# Altium schematic sheet Pixracer_V1_FMU_Alternative_4.SchDoc
size 335 x 216 mm; Origin: Eagle
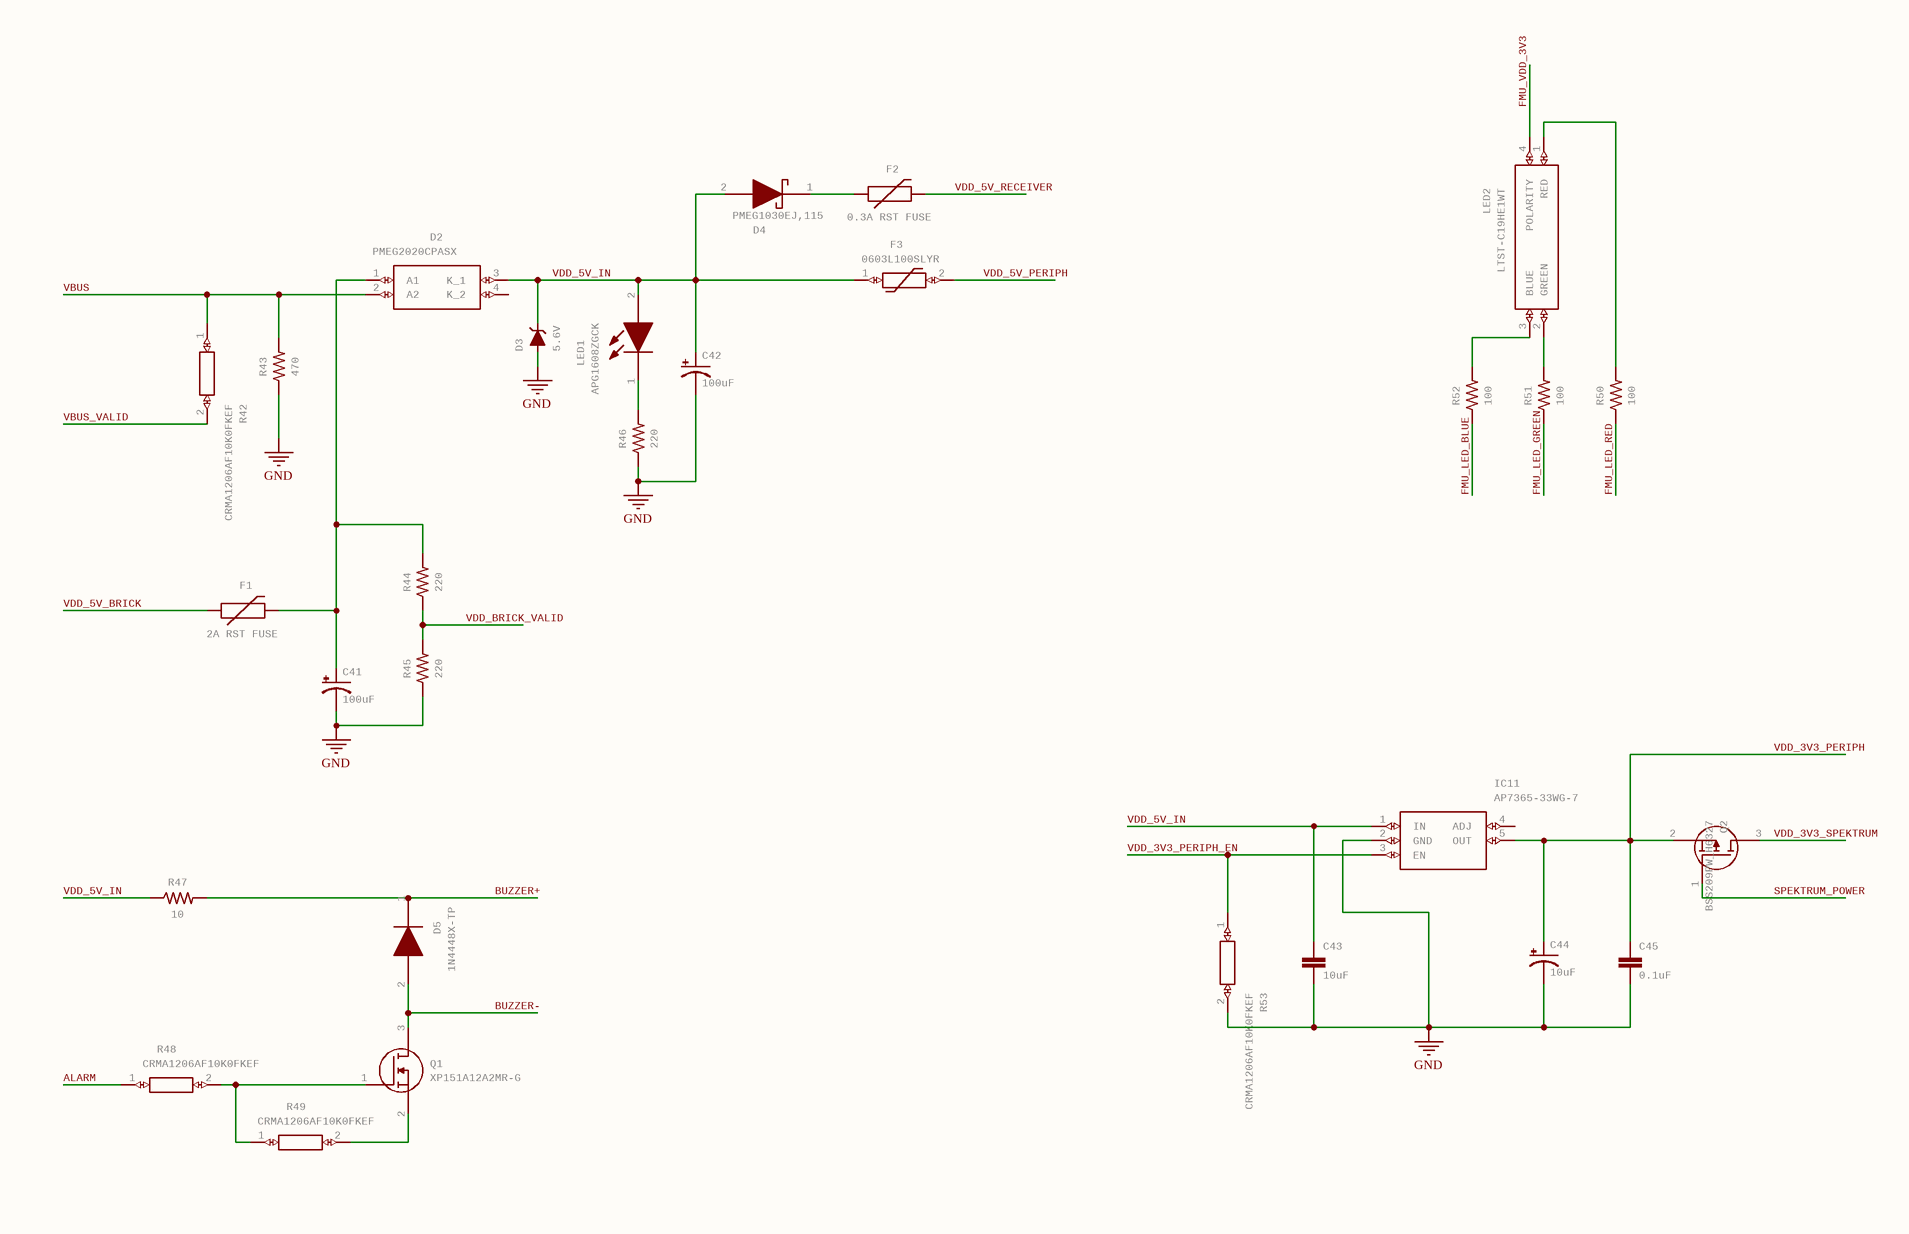
[diagram p0: Pixracer_V1_FMU_Alternative_4.SchDoc]

## Parts
C41  100uF  [1206-POLAR]
C42  100uF  [1206-POLAR]
C43  10uF  [1206]
C44  10uF  [0603-POLAR]
C45  0.1uF  [0603]
D2  PMEG2020CPASX  [PMEG2020CPASX]
D3  5.6V  [SOT23-3]
D4  PMEG1030EJ,115  [SODFL2512X80N]
D5  1N4448X-TP  [1N4448XTP]
F1  2A RST FUSE  [1206]
F2  0.3A RST FUSE  [0805]
F3  0603L100SLYR  [0603L050SLYR]
IC11  AP7365-33WG-7  [SOT95P285X130-5N]
LED1  APG1608ZGCK  [LEDC1608X28N]
LED2  LTST-C19HE1WT  [LTST-C19HE1WT]
Q1  XP151A12A2MR-G  [SOT95P280X130-3N]
Q2  BSS209PW_H6327  [SOT65P210X100-3N]
R42  CRMA1206AF10K0FKEF  [RESC3216X74N]
R43  470  [0603]
R44  220  [0603]
R45  220  [0603]
R46  220  [0603]
R47  10  [0603]
R48  CRMA1206AF10K0FKEF  [RESC3216X74N]
R49  CRMA1206AF10K0FKEF  [RESC3216X74N]
R50  100  [0603]
R51  100  [0603]
R52  100  [0603]
R53  CRMA1206AF10K0FKEF  [RESC3216X74N]

## Nets
GND: C41.2(-) C42.2(-) C43.2 C44.- C45.2 D3.1(A) IC11.2(GND) R43.1 R45.1 R46.1 R53.2
ALARM: R48.1
BUZZER+: D5.1(K) R47.2
BUZZER-: D5.2(A) Q1.3(D)
FMU_LED_BLUE: R52.1
FMU_LED_GREEN: R51.1
FMU_LED_RED: R50.1
FMU_VDD_3V3: LED2.4(POLARITY)
SPEKTRUM_POWER: Q2.1(G)
VBUS: D2.2(A2) R42.1 R43.2
VBUS_VALID: R42.2
VDD_3V3_PERIPH: C44.+ C45.1 IC11.5(OUT) Q2.2(S)
VDD_3V3_PERIPH_EN: IC11.3(EN) R53.1
VDD_3V3_SPEKTRUM: Q2.3(D)
VDD_5V_BRICK: F1.1
VDD_5V_IN: C42.1(+) C43.1 D2.3(K_1) D3.3(C) D4.2(A) F3.1 IC11.1(IN) LED1.2(A) R47.1
VDD_5V_PERIPH: F3.2
VDD_5V_RECEIVER: F2.2
VDD_BRICK_VALID: R44.1 R45.2
NetC41_1: C41.1(+) D2.1(A1) F1.2 R44.2
NetD4_1: D4.1(K) F2.1
NetLED1_1: LED1.1(K) R46.2
NetLED2_1: LED2.1(RED) R50.2
NetLED2_2: LED2.2(GREEN) R51.2
NetLED2_3: LED2.3(BLUE) R52.2
NetQ1_1: Q1.1(G) R48.2 R49.1
NetQ1_2: Q1.2(S) R49.2

Not connected (* = marked no-connect by the designer): D2 4(K_2); IC11 4(ADJ)

## Library data of the parts
C41 C42 = 100UF-POLAR-1206-6.3V-20%(TANT): 100ÂµF polarized capacitors    A capacitor is a passive two-terminal electrical component used to store electrical energy temporarily in an electric field.; GateName_1: G$1; SymbolName_1: CAP_POL; PROD_ID: CAP-14093; DeviceName: -1206-6.3V-20%(TANT); LibraryName: SparkFun-Capacitors; DeviceSetName: 100UF-POLAR
C43 = 10UF-1206-6.3V-20%: 10.0ÂµF ceramic capacitors    A capacitor is a passive two-terminal electrical component used to store electrical energy temporarily in an electric field.; GateName_1: G$1; SymbolName_1: CAP; PROD_ID: CAP-10057; DeviceName: -1206-6.3V-20%; LibraryName: SparkFun-Capacitors; DeviceSetName: 10UF
C44 = 10UF-POLAR-0603-6.3V-20%(TANT): 10.0ÂµF polarized capacitors    A capacitor is a passive two-terminal electrical component used to store electrical energy temporarily in an electric field.; GateName_1: G$1; SymbolName_1: CAP_POL; PROD_ID: CAP-13210; DeviceName: -0603-6.3V-20%(TANT); LibraryName: SparkFun-Capacitors; DeviceSetName: 10UF-POLAR
C45 = 0.1UF-0603-100V-10%-X7R-WE: 0.1ÂµF ceramic capacitors    A capacitor is a passive two-terminal electrical component used to store electrical energy temporarily in an electric field.; GateName_1: G$1; SymbolName_1: CAP; PROD_ID: CAP-16436; DeviceName: -0603-100V-10%-X7R-WE; LibraryName: SparkFun-Capacitors; DeviceSetName: 0.1UF
D2 = PMEG2020CPASX: Schottky Diodes & Rectifiers 20V 2A dual MEGA Schottky   Source:  Datasheet; MANUFACTURER_NAME: Nexperia; GateName_1: G$1; SymbolName_1: PMEG2020CPASX; LibraryName: SamacSys_Parts; DeviceSetName: PMEG2020CPASX; DESCRIPTION: Schottky Diodes & Rectifiers 20V 2A dual MEGA Schottky; HEIGHT: 0.65mm; MANUFACTURER_PART_NUMBER: PMEG2020CPASX; MOUSER_PART_NUMBER: 771-PMEG2020CPASX; MOUSER_PRICE-STOCK: https://www.mouser.co.uk/ProductDetail/Nexperia/PMEG2020CPASX?qs=K2OaAKmNuLimeK0EUCzHKQ%3D%3D
D3 = DIODE-ZENER-MMBZ5233BLT1G: Zener Diode    A Zener diode allows current to flow from its anode to its cathode like a normal semiconductor diode, but it also permits current to flow in the reverse direction when its "Zener voltage" is reached. - WIkipedia; GateName_1: G$1; PROD_ID: DIO-14123; SymbolName_1: DIODE-ZENER; DeviceName: -MMBZ5233BLT1G; LibraryName: SparkFun-DiscreteSemi; DeviceSetName: DIODE-ZENER
D4 = PMEG1030EJ,115: Schottky Diodes & Rectifiers SCHOTTKY 10V 3A   Source:  Datasheet; MANUFACTURER_NAME: Nexperia; GateName_1: G$1; SymbolName_1: PMEG1030EJ,115; LibraryName: SamacSys_Parts; DeviceSetName: PMEG1030EJ,115; DESCRIPTION: Schottky Diodes & Rectifiers SCHOTTKY 10V 3A; HEIGHT: 0.8mm; MANUFACTURER_PART_NUMBER: PMEG1030EJ,115; MOUSER_PART_NUMBER: 771-PMEG1030EJ-T/R; MOUSER_PRICE-STOCK: https://www.mouser.co.uk/ProductDetail/Nexperia/PMEG1030EJ115?qs=LOCUfHb8d9vmk7P%2FuYbs5A%3D%3D
D5 = 1N4448X-TP: Diodes - General Purpose, Power, Switching 250mA 75V 500mA 250mA 150mW 75Vbr   Source:  Datasheet; MANUFACTURER_NAME: Micro Commercial Components (MCC); GateName_1: G$1; SymbolName_1: 1N4448X-TP; LibraryName: SamacSys_Parts; DeviceSetName: 1N4448X-TP; DESCRIPTION: Diodes - General Purpose, Power, Switching 250mA 75V 500mA 250mA 150mW 75Vbr; HEIGHT: 0.65mm; MANUFACTURER_PART_NUMBER: 1N4448X-TP; MOUSER_PART_NUMBER: 833-1N4448X-TP; MOUSER_PRICE-STOCK: https://www.mouser.com/Search/Refine.aspx?Keyword=833-1N4448X-TP
F1 = PPTC_6V500MA-2: Resettable Fuse PPTC    Resettable Fuse. Really a sort of resistor with a polymeric positive temperature coefficient whose resistance increases dramatically with an increase in temperature. When heated by the power passing through the resistance rises causing the current to be limited, protecting the circuit. This is achieved by the transition of the polymer from a crystalline to an amorphous state where the conductive carbon separates breaking the conductive pathways found in the cool crystalline structure. When a PPTC cools back down it resumes conducting letting the circuit turn back on.   SparkFun Products:  SparkFun RedBoard - Programmed with Arduino  Pro Micro - 5V/16MHz  Arduino Pro 328 - 5V/16MHz  MP3 Trigger; GateName_1: F1; PROD_ID: RES-08585; SymbolName_1: PPTC; DeviceName: _6V500MA-2; LibraryName: SparkFun-Fuses; DeviceSetName: PPTC
F2 = PPTC_6V500MA: Resettable Fuse PPTC    Resettable Fuse. Really a sort of resistor with a polymeric positive temperature coefficient whose resistance increases dramatically with an increase in temperature. When heated by the power passing through the resistance rises causing the current to be limited, protecting the circuit. This is achieved by the transition of the polymer from a crystalline to an amorphous state where the conductive carbon separates breaking the conductive pathways found in the cool crystalline structure. When a PPTC cools back down it resumes conducting letting the circuit turn back on.   SparkFun Products:  SparkFun RedBoard - Programmed with Arduino  Pro Micro - 5V/16MHz  Arduino Pro 328 - 5V/16MHz  MP3 Trigger; GateName_1: F1; PROD_ID: RES-13945; SymbolName_1: PPTC; DeviceName: _6V500MA; LibraryName: SparkFun-Fuses; DeviceSetName: PPTC
F3 = 0603L100SLYR: PTC 6V POLYFUSE SURF MOUNT 0603 SL 1.00A   Source:  Datasheet; MANUFACTURER_NAME: LITTELFUSE; GateName_1: G$1; SymbolName_1: 0603L100SLYR; LibraryName: SamacSys_Parts; DeviceSetName: 0603L100SLYR; DESCRIPTION: PTC 6V POLYFUSE SURF MOUNT 0603 SL 1.00A; HEIGHT: 0.75mm; MANUFACTURER_PART_NUMBER: 0603L100SLYR; MOUSER_PART_NUMBER: 576-0603L100SLYR; MOUSER_PRICE-STOCK: https://www.mouser.co.uk/ProductDetail/Littelfuse/0603L100SLYR?qs=%252BPPFKVzHyAKqCAJtLoK6vw%3D%3D
IC11 = AP7365-33WG-7: DiodesZetex AP7365-33WG-7, LDO Voltage Regulator, 600mA, 3.3 V +/-2%, 2  6 Vin, 5-Pin SOT-25   Source:  Datasheet; MANUFACTURER_NAME: Diodes Inc.; GateName_1: G$1; SymbolName_1: AP7365-33WG-7; LibraryName: SamacSys_Parts; DeviceSetName: AP7365-33WG-7; DESCRIPTION: DiodesZetex AP7365-33WG-7, LDO Voltage Regulator, 600mA, 3.3 V +/-2%, 2  6 Vin, 5-Pin SOT-25; HEIGHT: 1.3mm; MANUFACTURER_PART_NUMBER: AP7365-33WG-7; MOUSER_PART_NUMBER: 621-AP7365-33WG-7; MOUSER_PRICE-STOCK: https://www.mouser.co.uk/ProductDetail/Diodes-Incorporated/AP7365-33WG-7?qs=abZ1nkZpTuOZFvxvoFPL0w%3D%3D
LED1 = APG1608ZGCK: Standard LEDs - SMD 1.6X0.8MM   Source:  Datasheet; MANUFACTURER_NAME: Kingbright; GateName_1: G$1; SymbolName_1: APG1608ZGCK; LibraryName: SamacSys_Parts; DeviceSetName: APG1608ZGCK; DESCRIPTION: Standard LEDs - SMD 1.6X0.8MM; HEIGHT: 0.28mm; MANUFACTURER_PART_NUMBER: APG1608ZGCK; MOUSER_PART_NUMBER: 604-APG1608ZGCK; MOUSER_PRICE-STOCK: https://www.mouser.co.uk/ProductDetail/Kingbright/APG1608ZGCK?qs=Oo40KB9lBTmmOma0ledTcg%3D%3D
LED2 = LTST-C19HE1WT: LED,SMD,1.6x1.5x0.4mm,Red/Green/Blue Lite-On LTST-C19HE1WT 3 RGB LED, 470 / 525 / 624 nm 3-Pin, Rectangle Lens SMD package   Source:  Datasheet; GateName_1: G$1; SymbolName_1: LTST-C19HE1WT; LibraryName: SamacSys_Parts; DeviceSetName: LTST-C19HE1WT; DESCRIPTION: LED,SMD,1.6x1.5x0.4mm,Red/Green/Blue Lite-On LTST-C19HE1WT 3 RGB LED, 470 / 525 / 624 nm 3-Pin, Rectangle Lens SMD package; HEIGHT: mm; MANUFACTURER_NAME: Lite-On; MANUFACTURER_PART_NUMBER: LTST-C19HE1WT; MOUSER_PART_NUMBER: 859-LTST-C19HE1WT; MOUSER_PRICE-STOCK: https://www.mouser.co.uk/ProductDetail/Lite-On/LTST-C19HE1WT?qs=WAWaI72GHKxJLPArJA9%252BUw%3D%3D
Q1 = XP151A12A2MR-G: Power MOSFET   Source:  Datasheet; MANUFACTURER_NAME: Torex; GateName_1: G$1; SymbolName_1: XP151A12A2MR-G; LibraryName: SamacSys_Parts; DeviceSetName: XP151A12A2MR-G; DESCRIPTION: Power MOSFET; HEIGHT: 1.3mm; MANUFACTURER_PART_NUMBER: XP151A12A2MR-G; MOUSER_PART_NUMBER: 865-XP151A12A2MR-G; MOUSER_PRICE-STOCK: https://www.mouser.co.uk/ProductDetail/Torex-Semiconductor/XP151A12A2MR-G?qs=AsjdqWjXhJ%252BYt8dSaKx3TA%3D%3D
Q2 = BSS209PW_H6327: MOSFET P-Ch -20V -630mA SOT-323-3   Source:  Datasheet; MANUFACTURER_NAME: Infineon; MANUFACTURER_PART_NUMBER: BSS209PW H6327; GateName_1: G$1; SymbolName_1: BSS209PW_H6327; LibraryName: SamacSys_Parts; DeviceSetName: BSS209PW_H6327; DESCRIPTION: MOSFET P-Ch -20V -630mA SOT-323-3; HEIGHT: 1mm; MOUSER_PART_NUMBER: 726-BSS209PWH6327; MOUSER_PRICE-STOCK: https://www.mouser.com/Search/Refine.aspx?Keyword=726-BSS209PWH6327
R42 R48 R49 R53 = CRMA1206AF10K0FKEF: Thick Film Resistors - SMD 0.30W 10Kohm 1% AEC-Q200   Source:  Datasheet; MANUFACTURER_NAME: Vishay; GateName_1: G$1; SymbolName_1: CRMA1206AF10K0FKEF; LibraryName: SamacSys_Parts; DeviceSetName: CRMA1206AF10K0FKEF; DESCRIPTION: Thick Film Resistors - SMD 0.30W 10Kohm 1% AEC-Q200; HEIGHT: 0.74mm; MANUFACTURER_PART_NUMBER: CRMA1206AF10K0FKEF; MOUSER_PART_NUMBER: 71-CRMA1206AF10K0FKF; MOUSER_PRICE-STOCK: https://www.mouser.co.uk/ProductDetail/Vishay/CRMA1206AF10K0FKEF?qs=TiOZkKH1s2Q81nOs5FD1Wg%3D%3D
R43 = 470OHM-0603-1/10W-1%: 470Î© resistor    A resistor is a passive two-terminal electrical component that implements electrical resistance as a circuit element. Resistors act to reduce current flow, and, at the same time, act to lower voltage levels within circuits. - Wikipedia; GateName_1: G$1; DeviceSetName: 470OHM; PROD_ID: RES-07869; SymbolName_1: RESISTOR; DeviceName: -0603-1/10W-1%; LibraryName: SparkFun-Resistors
R44-R46 = 220OHM-0603-1/10W-1%: 220Î© resistor    A resistor is a passive two-terminal electrical component that implements electrical resistance as a circuit element. Resistors act to reduce current flow, and, at the same time, act to lower voltage levels within circuits. - Wikipedia; GateName_1: G$1; DeviceSetName: 220OHM; PROD_ID: RES-07861; SymbolName_1: RESISTOR; DeviceName: -0603-1/10W-1%; LibraryName: SparkFun-Resistors
R47 = 10OHM-0603-1/10W-5%: 10Î© resistor    A resistor is a passive two-terminal electrical component that implements electrical resistance as a circuit element. Resistors act to reduce current flow, and, at the same time, act to lower voltage levels within circuits. - Wikipedia; GateName_1: G$1; DeviceSetName: 10OHM; PROD_ID: RES-09834; SymbolName_1: RESISTOR; DeviceName: -0603-1/10W-5%; LibraryName: SparkFun-Resistors
R50-R52 = 100OHM-0603-1/10W-1%: 100Î© resistor    A resistor is a passive two-terminal electrical component that implements electrical resistance as a circuit element. Resistors act to reduce current flow, and, at the same time, act to lower voltage levels within circuits. - Wikipedia; GateName_1: G$1; DeviceSetName: 100OHM; PROD_ID: RES-07863; SymbolName_1: RESISTOR; DeviceName: -0603-1/10W-1%; LibraryName: SparkFun-Resistors